# EAGLE design xmosio3 (EAGLE 7.6.0)
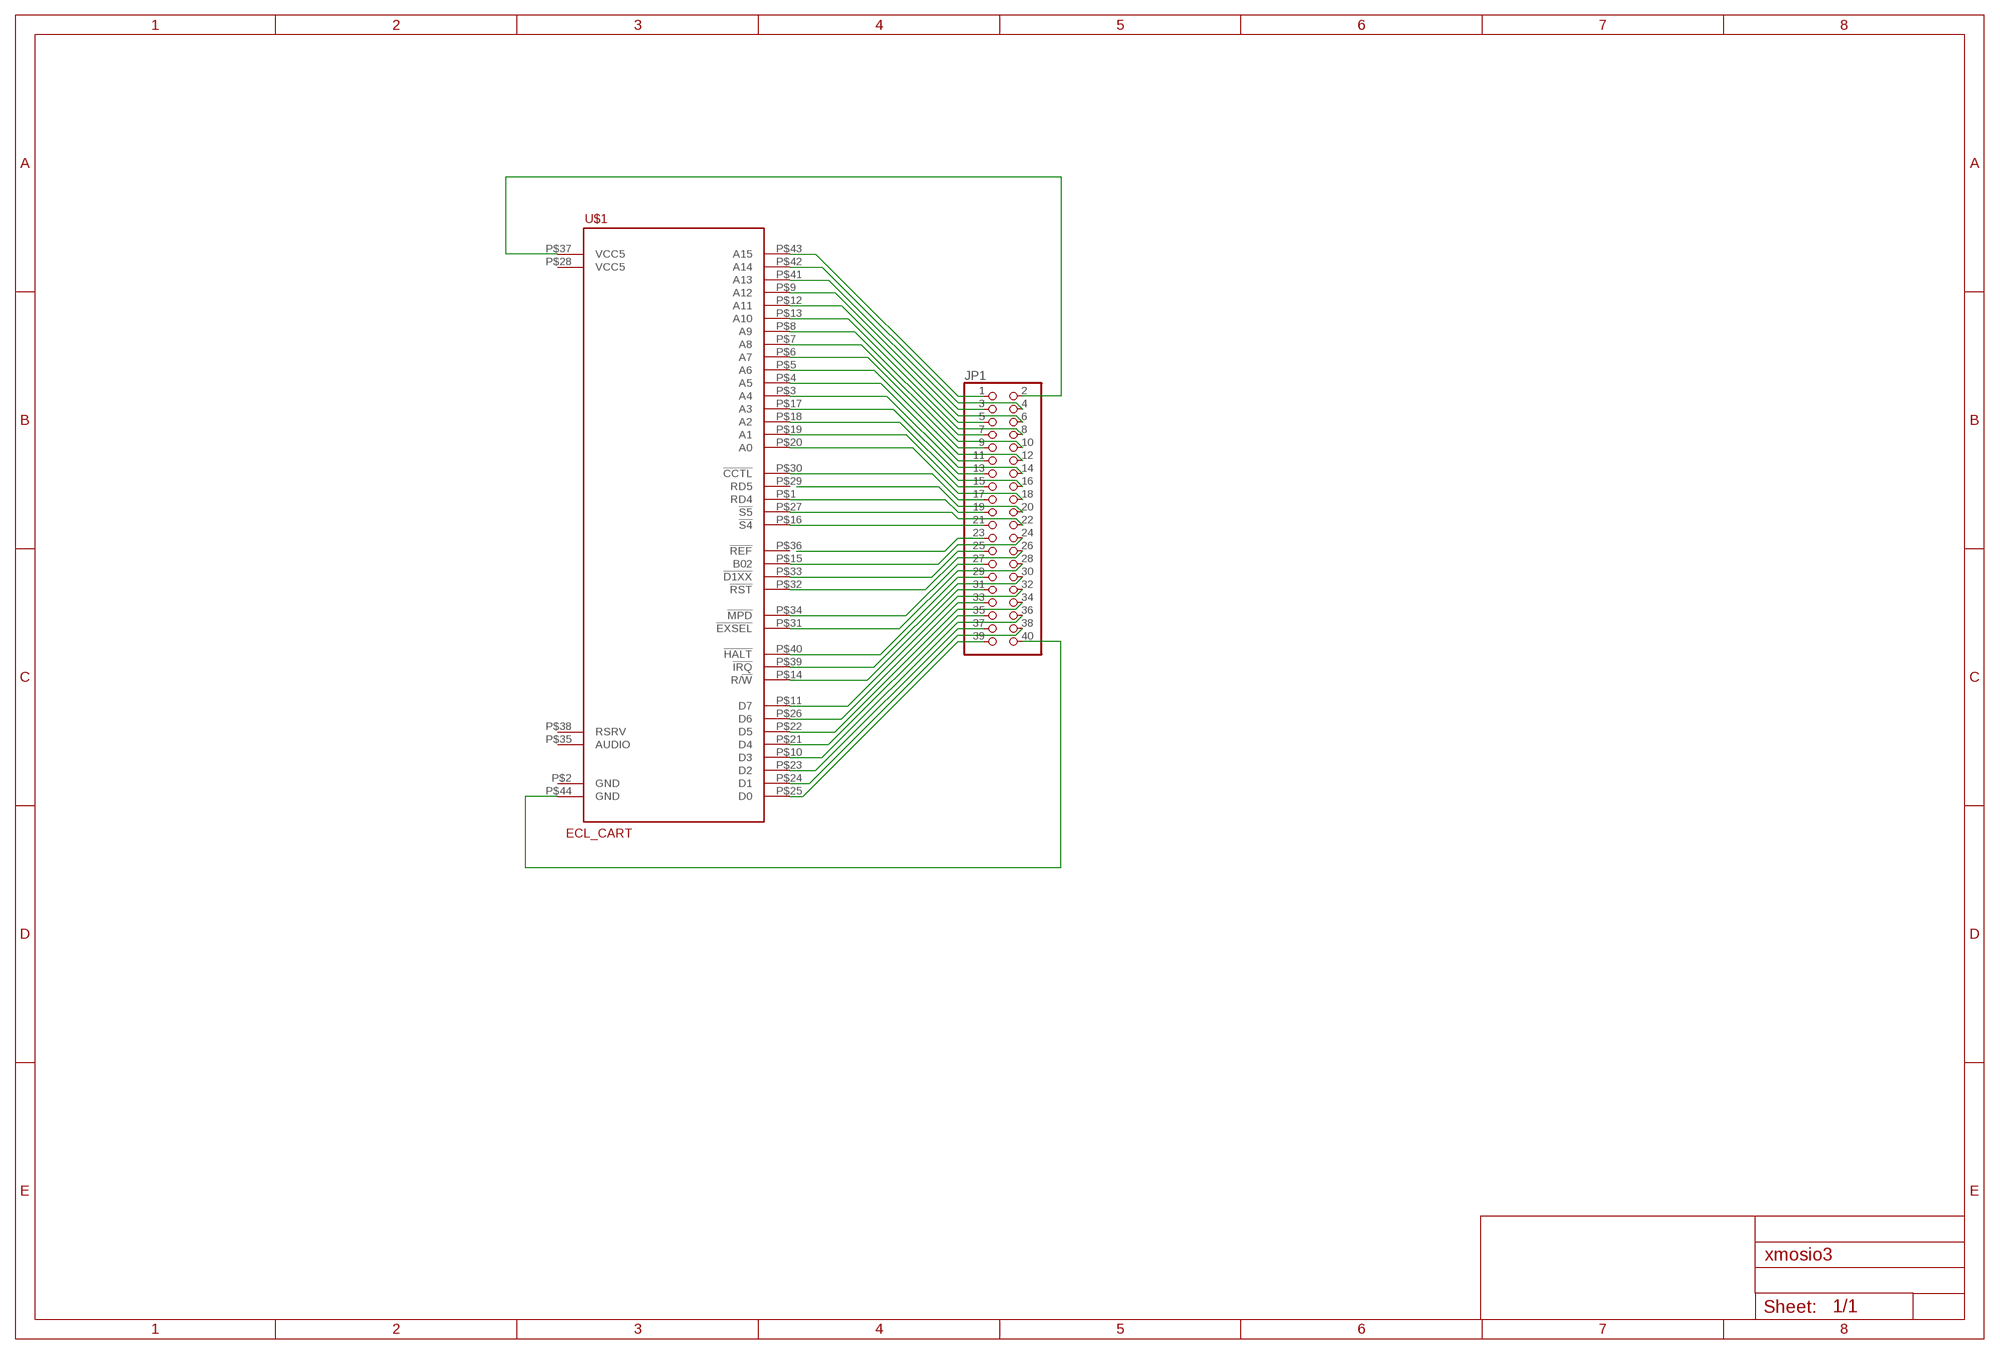
[diagram p0: schematic, sheet 1]

## Parts
JP1  PINHD-2X20/90  [2X20/90]
U$1  ECL_CART  [ECL_CART]

## Nets
N$1: JP1.2 U$1.P$37(VCC5)
N$2: JP1.1 U$1.P$43(A15)
N$3: JP1.4 U$1.P$42(A14)
N$4: JP1.3 U$1.P$41(A13)
N$5: JP1.6 U$1.P$9(A12)
N$6: JP1.5 U$1.P$12(A11)
N$7: JP1.8 U$1.P$13(A10)
N$8: JP1.7 U$1.P$8(A9)
N$9: JP1.10 U$1.P$7(A8)
N$10: JP1.9 U$1.P$6(A7)
N$11: JP1.12 U$1.P$5(A6)
N$12: JP1.11 U$1.P$4(A5)
N$13: JP1.14 U$1.P$3(A4)
N$14: JP1.13 U$1.P$17(A3)
N$15: JP1.16 U$1.P$18(A2)
N$16: JP1.15 U$1.P$19(A1)
N$17: JP1.18 U$1.P$20(A0)
N$18: JP1.17 U$1.P$30(!CCTL!)
N$19: JP1.20
N$20: JP1.19 U$1.P$1(RD4)
N$21: JP1.22 U$1.P$27(!S5!)
N$22: JP1.21 U$1.P$16(!S4!)
N$23: JP1.23
N$24: JP1.24 U$1.P$15(B02)
N$25: JP1.25 U$1.P$33(!D1XX!)
N$26: JP1.26 U$1.P$32(!RST!)
N$27: JP1.27 U$1.P$34(!MPD!)
N$28: JP1.28 U$1.P$31(!EXSEL!)
N$29: JP1.29 U$1.P$40(!HALT!)
N$30: JP1.30 U$1.P$39(!IRQ!)
N$31: JP1.31 U$1.P$14(R/!W!)
N$32: JP1.32 U$1.P$11(D7)
N$33: JP1.33 U$1.P$26(D6)
N$34: JP1.34 U$1.P$22(D5)
N$35: JP1.35 U$1.P$21(D4)
N$36: JP1.36 U$1.P$10(D3)
N$37: JP1.37 U$1.P$23(D2)
N$38: JP1.38 U$1.P$24(D1)
N$39: JP1.39 U$1.P$25(D0)
N$40: JP1.40 U$1.P$44(GND)
Unconnected: U$1.P$2(GND) U$1.P$28(VCC5) U$1.P$29(RD5) U$1.P$35(AUDIO) U$1.P$36(!REF!) U$1.P$38(RSRV)

## Library data of the parts
JP1 = pinhead:PINHD-2X20: PIN HEADER
U$1 = atari:ECL_CART

## Net classes
1 Power: width 0.305 mm, drill 0.203 mm, clearance 0.203 mm

## Board
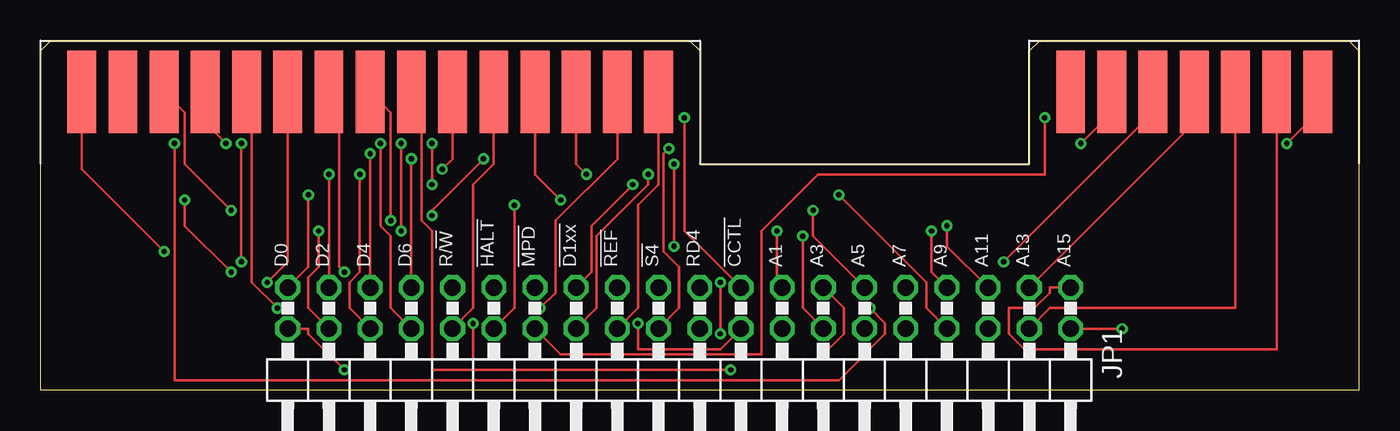
[diagram p1: board, top side]
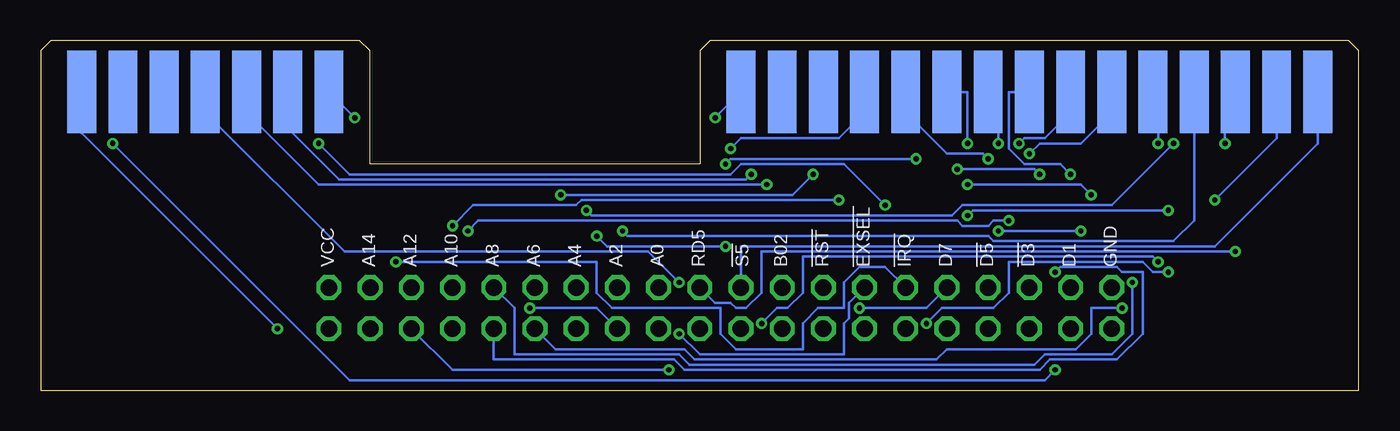
[diagram p2: board, bottom side, seen from below]

Size 81.28 x 21.59 mm. Coordinates in mm from the lower left corner, seen from the top.
Outline: 0,0 0,20.95 0.64,21.59 40.01,21.59 40.64,20.95 40.64,13.97 60.96,13.97 60.96,20.95 61.59,21.59 80.64,21.59 81.28,20.95 81.28,0 0,0
Copper layers (1*16): Top 0.0356mm / dielectric 1.5011mm / Bottom 0.0356mm
Design rules "oshpark-2layer": minimum track width 6mil, minimum drill 13mil, track to track 6mil, track to pad 6mil, pad to pad 6mil, via to via 6mil, smd to smd 6mil, copper to edge 15mil, drill to drill 6mil, minimum pad ring 7mil, minimum via ring 7mil, stop-mask expansion 2.5mil, vias tented up to drill 0mil, thermal gap 10mil
vRestrict: area 31.8,7.3 to 33.3,11.1; area 14.3,7.3 to 15.6,9.2; area 16.8,7.3 to 18.1,9.2; area 19.4,7.3 to 20.6,9.2; area 21.9,7.3 to 23.2,9.2; area 24.1,7.3 to 25.7,10.2; area 26.7,7.3 to 28.3,10.8; area 29.2,7.3 to 30.8,10.2; area 34.3,7.3 to 35.9,10.2; area 36.8,7.3 to 38.4,9.5; area 39.7,7.3 to 41,9.8; area 41.9,7.3 to 43.5,10.8; 8 more areas

### Footprints (pad centres in the part's own frame; a part is rotated, then mirrored left to right if it is on the bottom)
2X20/90 = drill 1.016 octagon: 1 -24.13,-6.35; 2 -24.13,-3.81; 3 -21.59,-6.35; 4 -21.59,-3.81; 5 -19.05,-6.35; 6 -19.05,-3.81; 7 -16.51,-6.35; 8 -16.51,-3.81; 9 -13.97,-6.35; 10 -13.97,-3.81; 11 -11.43,-6.35; 12 -11.43,-3.81; 13 -8.89,-6.35; 14 -8.89,-3.81; 15 -6.35,-6.35; 16 -6.35,-3.81; 17 -3.81,-6.35; 18 -3.81,-3.81; 19 -1.27,-6.35; 20 -1.27,-3.81; 21 1.27,-6.35; 22 1.27,-3.81; 23 3.81,-6.35; 24 3.81,-3.81; 25 6.35,-6.35; 26 6.35,-3.81; 27 8.89,-6.35; 28 8.89,-3.81; 29 11.43,-6.35; 30 11.43,-3.81; 31 13.97,-6.35; 32 13.97,-3.81; 33 16.51,-6.35; 34 16.51,-3.81; 35 19.05,-6.35; 36 19.05,-3.81; 37 21.59,-6.35; 38 21.59,-3.81; 39 24.13,-6.35; 40 24.13,-3.81
ECL_CART = smd 1.778 x 5.08: P$1 2.54,4.445; P$2 5.08,4.445; P$3 7.62,4.445; P$4 10.16,4.445; P$5 12.7,4.445; P$6 15.24,4.445; P$7 17.78,4.445; P$8 20.32,4.445; P$9 22.86,4.445; P$10 25.4,4.445; P$11 27.94,4.445; P$12 30.48,4.445; P$13 33.02,4.445; P$14 35.56,4.445; P$15 38.1,4.445; P$38 63.5,4.445; P$39 66.04,4.445; P$40 68.58,4.445; P$41 71.12,4.445; P$42 73.66,4.445; P$43 76.2,4.445; P$44 78.74,4.445 | smd 1.778 x 5.08 bottom: P$16 2.54,4.445; P$17 5.08,4.445; P$18 7.62,4.445; P$19 10.16,4.445; P$20 12.7,4.445; P$21 15.24,4.445; P$22 17.78,4.445; P$23 20.32,4.445; P$24 22.86,4.445; P$25 25.4,4.445; P$26 27.94,4.445; P$27 30.48,4.445; P$28 33.02,4.445; P$29 35.56,4.445; P$30 38.1,4.445; P$31 63.5,4.445; P$32 66.04,4.445; P$33 68.58,4.445; P$34 71.12,4.445; P$35 73.66,4.445; P$36 76.2,4.445; P$37 78.74,4.445

### Placement (x,y rotation side)
JP1  39.37,0 180 top
U$1  0,13.97 0 top

### Tracks (layer width: path | path; a pad name or v marks a point on that pad's centre or on a via)
N$1  (via drill 0.33)
  Top 0.152: v66.67,3.81 JP1.2
  Bottom 0.152: v66.67,3.81 78.74,15.88 U$1.P$37
N$2
  Top 0.152: JP1.1 62.23,6.35 62.23,6.03 61.28,5.08 59.69,5.08 59.69,3.49 60.64,2.54 76.2,2.54 U$1.P$43
N$3
  Top 0.152: JP1.4 62.23,5.08 73.66,5.08 U$1.P$42
N$4
  Top 0.152: JP1.3 71.12,16.51 U$1.P$41
N$5  (via drill 0.33)
  Top 0.152: v42.55,1.27 24.13,1.27 24.13,9.84 23.5,10.48 23.5,17.78 U$1.P$9
  Bottom 0.152: JP1.6 55.88,1.27 v42.55,1.27
N$6  (via drill 0.33)
  Top 0.152: JP1.5 55.88,8.89 v55.88,10.16 | v32.07,11.75 30.48,13.34 U$1.P$12
  Bottom 0.152: v55.88,10.16 54.61,11.43 48.26,11.43 47.94,11.75 v32.07,11.75
N$7  (via drill 0.33)
  Top 0.152: JP1.8 54.61,5.08 54.61,6.67 v49.21,12.06 | v33.66,13.34 33.02,13.97 U$1.P$13
  Bottom 0.152: v49.21,12.06 34.92,12.06 v33.66,13.34
N$8  (via drill 0.33)
  Top 0.152: JP1.7 54.93,7.3 v54.93,9.84 | v21.59,10.48 21.59,17.14 U$1.P$8
  Bottom 0.152: v54.93,9.84 54.29,10.48 24.77,10.48 24.45,10.16 22.86,10.16 22.54,10.48 v21.59,10.48
N$9  (via drill 0.33)
  Top 0.152: v18.73,7.3 18.41,7.62 18.41,17.78 U$1.P$7
  Bottom 0.152: JP1.10 53.34,1.91 42.23,1.91 41.59,1.27 19.68,1.27 19.05,1.91 14.92,1.91 13.34,3.49 13.34,7.3 14.61,7.3 14.92,7.62 18.41,7.62 v18.73,7.3
N$10  (via drill 0.33)
  Top 0.152: v13.97,6.67 15.24,7.94 U$1.P$6
  Bottom 0.152: JP1.9 52.07,5.08 52.07,2.22 41.91,2.22 41.27,1.59 20,1.59 19.37,2.22 15.24,2.22 13.97,3.49 v13.97,6.67
N$11  (via drill 0.33)
  Top 0.152: v14.61,5.08 13.02,6.67 13.02,18.1 U$1.P$5
  Bottom 0.152: JP1.12 49.53,2.54 41.59,2.54 40.96,1.91 26.04,1.91 25.4,2.54 17.46,2.54 16.51,3.49 16.51,5.08 v14.61,5.08
N$12  (via drill 0.33)
  Top 0.152: JP1.11 47.62,9.53 v47.62,11.11 | v11.43,15.24 10.16,16.51 U$1.P$4
  Bottom 0.152: v47.62,11.11 47.31,10.79 25.08,10.79 24.45,11.43 15.24,11.43 v11.43,15.24
N$13  (via drill 0.33)
  Top 0.152: JP1.14 46.99,5.08 v46.99,9.53 | v39.05,13.97 v39.05,8.89 | v27.3,14.29 24.13,11.11 v24.13,10.79 | v11.75,11.11 8.89,13.97 8.89,17.14 U$1.P$3
  Bottom 0.152: v46.99,9.53 46.35,8.89 v39.05,8.89 | v39.05,13.97 38.73,14.29 v27.3,14.29 | v24.13,10.79 23.81,11.11 v11.75,11.11
N$14  (via drill 0.33)
  Top 0.152: JP1.13 49.53,5.08 49.53,3.49 47.94,1.91 26.67,1.91 v26.67,4.13 | v11.75,7.3 8.89,10.16 v8.89,11.75
  Bottom 0.152: v26.67,4.13 25.72,5.08 22.54,5.08 21.59,6.03 21.59,7.94 13.34,7.94 12.7,7.3 v11.75,7.3 | v8.89,11.75 5.08,15.56 U$1.P$17
N$15  (via drill 0.33)
  Top 0.152: v51.12,5.08 52.07,4.13 52.07,3.49 49.21,0.64 8.26,0.64 v8.26,15.24
  Bottom 0.152: JP1.16 46.99,5.08 v51.12,5.08 | v8.26,15.24 8.26,18.41 U$1.P$18
N$16  (via drill 0.33)
  Top 0.152: JP1.15 45.4,6.67 v45.4,9.84
  Bottom 0.152: v45.4,9.84 45.09,9.53 22.86,9.53 22.54,9.21 11.43,9.21 10.16,10.48 U$1.P$19
N$17  (via drill 0.33)
  Top 0.152: JP1.18 41.91,2.54 36.83,2.54 v36.83,4.13 | v12.38,15.24 v12.38,7.94
  Bottom 0.152: v36.83,4.13 35.88,5.08 35.24,5.08 34.29,6.03 34.29,8.26 12.7,8.26 v12.38,7.94 | v12.38,15.24 12.38,18.41 U$1.P$20
N$18  (via drill 0.33)
  Top 0.152: JP1.17 39.69,9.84 v39.69,16.83
  Bottom 0.152: U$1.P$30 v39.69,16.83
N$20  (via drill 0.33)
  Top 0.152: v7.62,8.57 2.54,13.65 U$1.P$1
  Bottom 0.152: JP1.19 39.69,5.4 38.73,5.4 38.42,5.08 37.78,5.08 36.83,6.03 36.83,8.57 v7.62,8.57
N$21  (via drill 0.33)
  Top 0.152: JP1.22 39.37,5.08 39.37,7.62 38.42,8.57 38.42,14.61 v38.73,14.92
  Bottom 0.152: v38.73,14.92 38.1,15.56 32.07,15.56 30.48,17.14 U$1.P$27
N$22
  Bottom 0.152: JP1.21 38.1,8.89 8.89,8.89 2.54,15.24 U$1.P$16
N$24
  Top 0.152: JP1.24 36.83,5.08 36.83,11.43 38.1,12.7 U$1.P$15
N$25  (via drill 0.33)
  Top 0.152: JP1.25 33.97,7.3 33.97,10.16 v36.51,12.7
  Bottom 0.152: v36.51,12.7 64.14,12.7 68.58,17.14 U$1.P$33
N$26  (via drill 0.33)
  Top 0.152: JP1.26 34.29,5.08 34.29,9.53 37.47,12.7 v37.47,13.34
  Bottom 0.152: v37.47,13.34 37.78,13.02 62.87,13.02 66.04,16.19 U$1.P$32
N$27  (via drill 0.33)
  Top 0.152: v41.91,6.67 v41.91,3.49
  Bottom 0.152: JP1.27 31.43,5.4 31.43,4.45 31.75,4.13 31.75,2.22 40.64,2.22 v41.91,3.49 | v41.91,6.67 43.81,8.57 62.55,8.57 71.12,17.14 U$1.P$34
N$28  (via drill 0.33)
  Top 0.152: JP1.28 32.07,2.22 44.45,2.22 44.45,9.84 47.94,13.34 61.91,13.34 v61.91,16.83
  Bottom 0.152: U$1.P$31 v61.91,16.83
N$29  (via drill 0.33)
  Top 0.152: v59.37,7.94 68.58,17.14 U$1.P$40
  Bottom 0.152: JP1.29 29.21,7.62 30.8,7.62 31.75,6.67 31.75,5.08 33.34,5.08 34.29,4.13 34.29,2.54 38.42,2.54 39.37,3.49 39.37,5.08 46.04,5.08 46.99,6.03 46.99,7.94 v59.37,7.94
N$30  (via drill 0.33)
  Top 0.152: JP1.30 29.21,5.08 v29.21,11.43 | v64.14,15.24 66.04,17.14 U$1.P$39
  Bottom 0.152: v29.21,11.43 31.75,13.97 38.1,13.97 38.73,13.34 62.23,13.34 v64.14,15.24
N$31  (via drill 0.33)
  Top 0.152: v30.8,5.08 31.75,6.03 31.75,10.48 35.56,14.29 U$1.P$14
  Bottom 0.152: JP1.31 26.67,5.08 v30.8,5.08
N$32
  Top 0.152: JP1.32 26.67,5.08 26.67,12.7 27.94,13.97 U$1.P$11
N$33  (via drill 0.33)
  Top 0.152: v22.86,14.29 JP1.33
  Bottom 0.152: v22.86,14.29 23.18,14.61 25.4,14.61 27.94,17.14 U$1.P$26
N$34  (via drill 0.33)
  Top 0.152: JP1.34 21.59,5.08 21.59,9.53 20.95,10.16 v20.95,15.24
  Bottom 0.152: v20.95,15.24 20.64,15.56 19.37,15.56 17.78,17.14 U$1.P$22
N$35  (via drill 0.33)
  Top 0.152: v20.32,14.61 JP1.35
  Bottom 0.152: v20.32,14.61 19.68,15.24 17.14,15.24 15.24,17.14 U$1.P$21
N$36  (via drill 0.33)
  Top 0.152: JP1.36 19.05,5.08 19.05,6.67 19.68,7.3 v19.68,13.34 | v24.77,13.65 25.4,14.29 U$1.P$10
  Bottom 0.152: v19.68,13.34 20,13.65 v24.77,13.65
N$37  (via drill 0.33)
  Top 0.152: v17.78,13.34 JP1.37
  Bottom 0.152: v17.78,13.34 18.41,13.97 20.64,13.97 21.59,14.92 21.59,18.41 U$1.P$23
N$38  (via drill 0.33)
  Top 0.152: JP1.38 16.51,5.08 16.51,6.99 17.14,7.62 v17.14,9.84 | v22.23,15.24 v22.23,9.84
  Bottom 0.152: v22.23,9.84 v17.14,9.84 | v22.23,15.24 22.23,18.41 U$1.P$24
N$39  (via drill 0.33)
  Top 0.152: JP1.39 16.51,7.62 v16.51,12.06 | v24.13,15.24 v24.13,12.7
  Bottom 0.152: v16.51,12.06 17.14,12.7 v24.13,12.7 | v24.13,15.24 24.13,18.41 U$1.P$25
N$40  (via drill 0.33)
  Top 0.152: JP1.40 16.51,3.81 16.51,3.49 v18.73,1.27 | v76.83,15.24 78.74,17.14 U$1.P$44
  Bottom 0.152: v18.73,1.27 19.37,0.64 62.23,0.64 v76.83,15.24

### Text on the board
tPlace: D0 | D2 | D4 | D6 | R/!W! | !HALT! | !MPD! | !D1xx! | !REF! | !S4! | RD4 | !CCTL! | A1 | A3 | A5 | A7 | A9 | A11 | A13 | A15
bPlace: GND | D1 | !D3! | !D5! | D7 | !IRQ! | !EXSEL! | !RST! | B02 | !S5! | RD5 | A0 | A2 | A4 | A6 | A8 | A10 | A12 | A14 | VCC